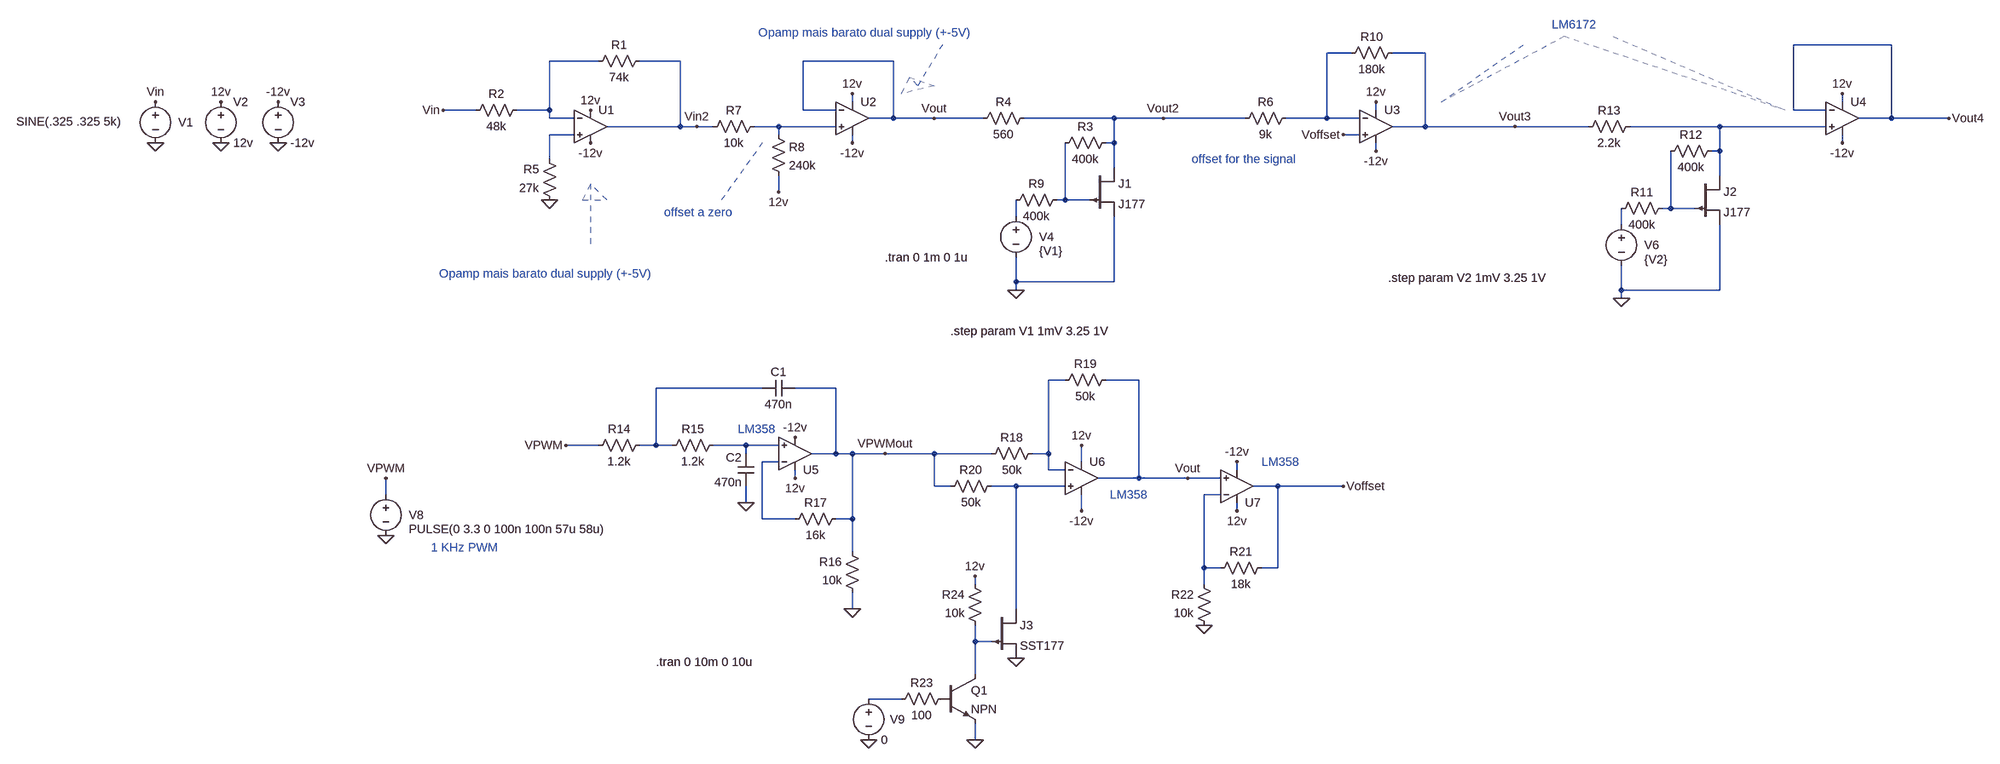
[diagram p0: schematic opamp_cir.asc]
opamp_cir.asc, the LTspice schematic file:
Version 4
SHEET 1 880 680
WIRE -544 -1792 -736 -1792
WIRE -1600 -1776 -1648 -1776
WIRE -1456 -1776 -1520 -1776
WIRE -3072 -1760 -3168 -1760
WIRE -2912 -1760 -2992 -1760
WIRE -2496 -1760 -2672 -1760
WIRE -2576 -1680 -2576 -1696
WIRE -640 -1680 -640 -1696
WIRE -3312 -1664 -3376 -1664
WIRE -3168 -1664 -3168 -1760
WIRE -3168 -1664 -3232 -1664
WIRE -2672 -1664 -2672 -1760
WIRE -2608 -1664 -2672 -1664
WIRE -1552 -1664 -1552 -1680
WIRE -736 -1664 -736 -1792
WIRE -672 -1664 -736 -1664
WIRE -3168 -1648 -3168 -1664
WIRE -3120 -1648 -3168 -1648
WIRE -2496 -1648 -2496 -1760
WIRE -2496 -1648 -2544 -1648
WIRE -2416 -1648 -2496 -1648
WIRE -2320 -1648 -2416 -1648
WIRE -2064 -1648 -2240 -1648
WIRE -1968 -1648 -2064 -1648
WIRE -1808 -1648 -1968 -1648
WIRE -1648 -1648 -1648 -1776
WIRE -1648 -1648 -1728 -1648
WIRE -1584 -1648 -1648 -1648
WIRE -544 -1648 -544 -1792
WIRE -544 -1648 -608 -1648
WIRE -432 -1648 -544 -1648
WIRE -2912 -1632 -2912 -1760
WIRE -2912 -1632 -3056 -1632
WIRE -2880 -1632 -2912 -1632
WIRE -2848 -1632 -2880 -1632
WIRE -2720 -1632 -2768 -1632
WIRE -2608 -1632 -2720 -1632
WIRE -1456 -1632 -1456 -1776
WIRE -1456 -1632 -1520 -1632
WIRE -1280 -1632 -1456 -1632
WIRE -1136 -1632 -1280 -1632
WIRE -880 -1632 -1056 -1632
WIRE -672 -1632 -880 -1632
WIRE -3120 -1616 -3168 -1616
WIRE -2720 -1616 -2720 -1632
WIRE -1584 -1616 -1616 -1616
WIRE -2576 -1600 -2576 -1616
WIRE -2064 -1600 -2064 -1648
WIRE -2064 -1600 -2080 -1600
WIRE -640 -1600 -640 -1616
WIRE -1552 -1584 -1552 -1600
WIRE -880 -1584 -880 -1632
WIRE -880 -1584 -896 -1584
WIRE -3168 -1568 -3168 -1616
WIRE -2064 -1552 -2064 -1600
WIRE -880 -1536 -880 -1584
WIRE -2720 -1504 -2720 -1536
WIRE -2160 -1488 -2160 -1600
WIRE -2160 -1488 -2176 -1488
WIRE -2112 -1488 -2160 -1488
WIRE -976 -1472 -976 -1584
WIRE -976 -1472 -992 -1472
WIRE -928 -1472 -976 -1472
WIRE -2256 -1456 -2256 -1488
WIRE -1072 -1440 -1072 -1472
WIRE -2256 -1328 -2256 -1376
WIRE -2064 -1328 -2064 -1456
WIRE -2064 -1328 -2256 -1328
WIRE -2256 -1312 -2256 -1328
WIRE -1072 -1312 -1072 -1360
WIRE -880 -1312 -880 -1440
WIRE -880 -1312 -1072 -1312
WIRE -1072 -1296 -1072 -1312
WIRE -2160 -1136 -2192 -1136
WIRE -2016 -1136 -2080 -1136
WIRE -2752 -1120 -2960 -1120
WIRE -2608 -1120 -2688 -1120
WIRE -3072 -1008 -3136 -1008
WIRE -2960 -1008 -2960 -1120
WIRE -2960 -1008 -2992 -1008
WIRE -2928 -1008 -2960 -1008
WIRE -2784 -1008 -2848 -1008
WIRE -2720 -1008 -2784 -1008
WIRE -2784 -992 -2784 -1008
WIRE -2608 -992 -2608 -1120
WIRE -2608 -992 -2656 -992
WIRE -2576 -992 -2608 -992
WIRE -2512 -992 -2576 -992
WIRE -2416 -992 -2512 -992
WIRE -2304 -992 -2416 -992
WIRE -2192 -992 -2192 -1136
WIRE -2192 -992 -2224 -992
WIRE -2720 -976 -2752 -976
WIRE -2128 -976 -2128 -1008
WIRE -2192 -960 -2192 -992
WIRE -2160 -960 -2192 -960
WIRE -1824 -960 -1824 -976
WIRE -2688 -944 -2688 -960
WIRE -2016 -944 -2016 -1136
WIRE -2016 -944 -2096 -944
WIRE -1920 -944 -2016 -944
WIRE -1856 -944 -1920 -944
WIRE -2416 -928 -2416 -992
WIRE -2384 -928 -2416 -928
WIRE -2256 -928 -2304 -928
WIRE -2160 -928 -2256 -928
WIRE -1744 -928 -1792 -928
WIRE -1616 -928 -1744 -928
WIRE -3488 -912 -3488 -944
WIRE -1856 -912 -1888 -912
WIRE -2784 -896 -2784 -928
WIRE -2128 -880 -2128 -912
WIRE -1824 -880 -1824 -896
WIRE -2752 -864 -2752 -976
WIRE -2688 -864 -2752 -864
WIRE -2576 -864 -2576 -992
WIRE -2576 -864 -2608 -864
WIRE -2576 -800 -2576 -864
WIRE -1888 -768 -1888 -912
WIRE -1856 -768 -1888 -768
WIRE -1744 -768 -1744 -928
WIRE -1744 -768 -1776 -768
WIRE -2336 -736 -2336 -752
WIRE -1888 -736 -1888 -768
WIRE -2576 -688 -2576 -720
WIRE -2256 -688 -2256 -928
WIRE -2336 -624 -2336 -656
WIRE -2304 -624 -2336 -624
WIRE -2336 -560 -2336 -624
WIRE -2480 -512 -2544 -512
WIRE -2336 -432 -2336 -464
FLAG -3952 -1600 0
FLAG -2416 -1648 Vout
FLAG -3712 -1600 0
FLAG -3824 -1600 0
FLAG -3824 -1680 12v
FLAG -3712 -1680 -12v
FLAG -3088 -1600 -12v
FLAG -3088 -1664 12v
FLAG -2880 -1632 Vin2
FLAG -2576 -1696 12v
FLAG -2576 -1600 -12v
FLAG -2720 -1504 12v
FLAG -2256 -1312 0
FLAG -3952 -1680 Vin
FLAG -3376 -1664 Vin
FLAG -3168 -1488 0
FLAG -1968 -1648 Vout2
FLAG -1552 -1680 12v
FLAG -1552 -1584 -12v
FLAG -1280 -1632 Vout3
FLAG -1072 -1296 0
FLAG -640 -1696 12v
FLAG -640 -1600 -12v
FLAG -432 -1648 Vout4
FLAG -1616 -1616 Voffset
FLAG -3488 -832 0
FLAG -3488 -944 VPWM
FLAG -3136 -1008 VPWM
FLAG -2688 -944 12v
FLAG -2688 -1024 -12v
FLAG -2784 -896 0
FLAG -2576 -688 0
FLAG -2512 -992 VPWMout
FLAG -2128 -1008 12v
FLAG -2128 -880 -12v
FLAG -1920 -944 Vout
FLAG -2256 -592 0
FLAG -2544 -432 0
FLAG -1824 -880 12v
FLAG -1824 -976 -12v
FLAG -1888 -656 0
FLAG -2336 -432 0
FLAG -2336 -752 12v
FLAG -1616 -928 Voffset
SYMBOL voltage -3952 -1696 R0
WINDOW 0 45 56 Left 2
WINDOW 3 -272 54 Left 2
WINDOW 123 0 0 Left 0
WINDOW 39 0 0 Left 0
SYMATTR InstName V1
SYMATTR Value SINE(.325 .325 5k)
SYMBOL res -2976 -1776 R90
WINDOW 0 0 56 VBottom 2
WINDOW 3 32 56 VTop 2
SYMATTR InstName R1
SYMATTR Value 74k
SYMBOL res -3216 -1680 R90
WINDOW 0 0 56 VBottom 2
WINDOW 3 32 56 VTop 2
SYMATTR InstName R2
SYMATTR Value 48k
SYMBOL Opamps\\UniversalOpamp2 -3088 -1632 R0
SYMATTR InstName U1
SYMBOL voltage -3824 -1696 R0
WINDOW 123 0 0 Left 0
WINDOW 39 0 0 Left 0
SYMATTR InstName V2
SYMATTR Value 12v
SYMBOL voltage -3712 -1696 R0
WINDOW 123 0 0 Left 0
WINDOW 39 0 0 Left 0
SYMATTR InstName V3
SYMATTR Value -12v
SYMBOL Opamps\\UniversalOpamp2 -2576 -1648 R0
SYMATTR InstName U2
SYMBOL res -2736 -1632 R0
SYMATTR InstName R8
SYMATTR Value 240k
SYMBOL res -2752 -1648 R90
WINDOW 0 0 56 VBottom 2
WINDOW 3 32 56 VTop 2
SYMATTR InstName R7
SYMATTR Value 10k
SYMBOL voltage -2256 -1472 R0
WINDOW 0 45 56 Left 2
WINDOW 3 45 84 Left 2
WINDOW 123 0 0 Left 0
WINDOW 39 0 0 Left 0
SYMATTR InstName V4
SYMATTR Value {V1}
SYMBOL pjf -2112 -1552 R0
SYMATTR InstName J1
SYMATTR Value J177
SYMBOL res -3152 -1472 R180
WINDOW 0 36 76 Left 2
WINDOW 3 36 40 Left 2
SYMATTR InstName R5
SYMATTR Value 27k
SYMBOL res -2272 -1472 R270
WINDOW 0 32 56 VTop 2
WINDOW 3 0 56 VBottom 2
SYMATTR InstName R9
SYMATTR Value 400k
SYMBOL res -2176 -1584 R270
WINDOW 0 32 56 VTop 2
WINDOW 3 0 56 VBottom 2
SYMATTR InstName R3
SYMATTR Value 400k
SYMBOL res -2336 -1632 R270
WINDOW 0 32 56 VTop 2
WINDOW 3 0 56 VBottom 2
SYMATTR InstName R4
SYMATTR Value 560
SYMBOL Opamps\\UniversalOpamp2 -1552 -1632 R0
SYMATTR InstName U3
SYMBOL res -1712 -1664 R90
WINDOW 0 0 56 VBottom 2
WINDOW 3 32 56 VTop 2
SYMATTR InstName R6
SYMATTR Value 9k
SYMBOL res -1504 -1792 R90
WINDOW 0 0 56 VBottom 2
WINDOW 3 32 56 VTop 2
SYMATTR InstName R10
SYMATTR Value 180k
SYMBOL voltage -1072 -1456 R0
WINDOW 0 45 56 Left 2
WINDOW 3 45 84 Left 2
WINDOW 123 0 0 Left 0
WINDOW 39 0 0 Left 0
SYMATTR InstName V6
SYMATTR Value {V2}
SYMBOL pjf -928 -1536 R0
SYMATTR InstName J2
SYMATTR Value J177
SYMBOL res -1088 -1456 R270
WINDOW 0 32 56 VTop 2
WINDOW 3 0 56 VBottom 2
SYMATTR InstName R11
SYMATTR Value 400k
SYMBOL res -992 -1568 R270
WINDOW 0 32 56 VTop 2
WINDOW 3 0 56 VBottom 2
SYMATTR InstName R12
SYMATTR Value 400k
SYMBOL res -1152 -1616 R270
WINDOW 0 32 56 VTop 2
WINDOW 3 0 56 VBottom 2
SYMATTR InstName R13
SYMATTR Value 2.2k
SYMBOL Opamps\\UniversalOpamp2 -640 -1648 R0
SYMATTR InstName U4
SYMBOL voltage -3488 -928 R0
WINDOW 0 45 56 Left 2
WINDOW 3 45 84 Left 2
WINDOW 123 0 0 Left 0
WINDOW 39 0 0 Left 0
SYMATTR InstName V8
SYMATTR Value PULSE(0 3.3 0 100n 100n 57u 58u)
SYMBOL res -2976 -1024 R90
WINDOW 0 0 56 VBottom 2
WINDOW 3 32 56 VTop 2
SYMATTR InstName R14
SYMATTR Value 1.2k
SYMBOL res -2832 -1024 R90
WINDOW 0 0 56 VBottom 2
WINDOW 3 32 56 VTop 2
SYMATTR InstName R15
SYMATTR Value 1.2k
SYMBOL res -2560 -704 R180
WINDOW 0 36 76 Left 2
WINDOW 3 36 40 Left 2
SYMATTR InstName R16
SYMATTR Value 10k
SYMBOL res -2704 -848 R270
WINDOW 0 32 56 VTop 2
WINDOW 3 0 56 VBottom 2
SYMATTR InstName R17
SYMATTR Value 16k
SYMBOL cap -2688 -1136 R90
WINDOW 0 0 32 VBottom 2
WINDOW 3 32 32 VTop 2
SYMATTR InstName C1
SYMATTR Value 470n
SYMBOL cap -2768 -928 R180
WINDOW 0 24 56 Left 2
WINDOW 3 24 8 Left 2
SYMATTR InstName C2
SYMATTR Value 470n
SYMBOL Opamps\\UniversalOpamp2 -2688 -992 M180
SYMATTR InstName U5
SYMBOL Opamps\\UniversalOpamp2 -2128 -944 R0
SYMATTR InstName U6
SYMBOL res -2208 -1008 R90
WINDOW 0 0 56 VBottom 2
WINDOW 3 32 56 VTop 2
SYMATTR InstName R18
SYMATTR Value 50k
SYMBOL res -2064 -1152 R90
WINDOW 0 0 56 VBottom 2
WINDOW 3 32 56 VTop 2
SYMATTR InstName R19
SYMATTR Value 50k
SYMBOL pjf -2304 -688 R0
SYMATTR InstName J3
SYMATTR Value SST177
SYMBOL res -2288 -944 R90
WINDOW 0 0 56 VBottom 2
WINDOW 3 32 56 VTop 2
SYMATTR InstName R20
SYMATTR Value 50k
SYMBOL voltage -2544 -528 R0
WINDOW 123 0 0 Left 0
WINDOW 39 0 0 Left 0
WINDOW 0 42 56 Left 2
SYMATTR InstName V9
SYMATTR Value 0
SYMBOL Opamps\\UniversalOpamp2 -1824 -928 M180
SYMATTR InstName U7
SYMBOL res -1760 -784 R90
WINDOW 0 0 56 VBottom 2
WINDOW 3 32 56 VTop 2
SYMATTR InstName R21
SYMATTR Value 18k
SYMBOL res -1872 -640 R180
WINDOW 0 36 76 Left 2
WINDOW 3 36 40 Left 2
SYMATTR InstName R22
SYMATTR Value 10k
SYMBOL npn -2400 -560 R0
SYMATTR InstName Q1
SYMBOL res -2384 -528 R90
WINDOW 0 0 56 VBottom 2
WINDOW 3 32 56 VTop 2
SYMATTR InstName R23
SYMATTR Value 100
SYMBOL res -2320 -640 R180
WINDOW 0 36 76 Left 2
WINDOW 3 36 40 Left 2
SYMATTR InstName R24
SYMATTR Value 10k
TEXT -1528 -1336 Left 2 !.step param V2 1mV 3.25 1V
TEXT -2512 -1376 Left 2 !.tran 0 1m 0 1u
TEXT -3384 -1344 Left 2 ;Opamp mais barato dual supply (+-5V)
TEXT -2760 -1816 Left 2 ;Opamp mais barato dual supply (+-5V)
TEXT -2944 -1464 Left 2 ;offset a zero
TEXT -2384 -1232 Left 2 !.step param V1 1mV 3.25 1V
TEXT -1208 -1832 Left 2 ;LM6172
TEXT -1912 -1568 Left 2 ;offset for the signal
TEXT -3400 -808 Left 2 ;1 KHz PWM
TEXT -2960 -584 Left 2 !.tran 0 10m 0 10u
TEXT -2072 -912 Left 2 ;LM358
TEXT -2800 -1040 Left 2 ;LM358
TEXT -1776 -976 Left 2 ;LM358
LINE Normal -3088 -1520 -3088 -1392 2
LINE Normal -3056 -1488 -3088 -1520 2
LINE Normal -3104 -1488 -3056 -1488 2
LINE Normal -3088 -1520 -3104 -1488 2
LINE Normal -2480 -1696 -2464 -1728 2
LINE Normal -2416 -1712 -2480 -1696 2
LINE Normal -2464 -1728 -2416 -1712 2
LINE Normal -2448 -1712 -2464 -1728 2
LINE Normal -2400 -1792 -2448 -1712 2
LINE Normal -2752 -1600 -2832 -1488 2
LINE Normal -1424 -1680 -1264 -1792 2
LINE Normal -1184 -1808 -1424 -1680 2
LINE Normal -752 -1664 -1184 -1808 2
LINE Normal -1088 -1808 -752 -1664 2

The netlist it stands for:
* opamp_cir.asc
V1 Vin 0 SINE(.325 .325 5k)
R1 Vin2 N002 74k
R2 N002 Vin 48k
XU1 N005 N002 12v -12v Vin2 level.2 Avol=1Meg GBW=10Meg Slew=10Meg ilimit=25m rail=0 Vos=0 phimargin=45 en=0 enk=0 in=0 ink=0 Rin=500Meg  ; pins IN+ IN- V+ V- OUT
V2 12v 0 12v
V3 -12v 0 -12v
XU2 N003 Vout 12v -12v Vout level.2 Avol=1Meg GBW=10Meg Slew=10Meg ilimit=25m rail=0 Vos=0 phimargin=45 en=0 enk=0 in=0 ink=0 Rin=500Meg  ; pins IN+ IN- V+ V- OUT
R8 N003 12v 240k
R7 N003 Vin2 10k
V4 N008 0 {V1}
J1 Vout2 N006 0 J177
R5 0 N005 27k
R9 N008 N006 400k
R3 N006 Vout2 400k
R4 Vout Vout2 560
XU3 Voffset N001 12v -12v Vout3 level.2 Avol=1Meg GBW=10Meg Slew=10Meg ilimit=25m rail=0 Vos=0 phimargin=45 en=0 enk=0 in=0 ink=0 Rin=500Meg  ; pins IN+ IN- V+ V- OUT
R6 N001 Vout2 9k
R10 Vout3 N001 180k
V6 N009 0 {V2}
J2 N004 N007 0 J177
R11 N009 N007 400k
R12 N007 N004 400k
R13 Vout3 N004 2.2k
XU4 N004 Vout4 12v -12v Vout4 level.2 Avol=1Meg GBW=10Meg Slew=10Meg ilimit=25m rail=0 Vos=0 phimargin=45 en=0 enk=0 in=0 ink=0 Rin=500Meg  ; pins IN+ IN- V+ V- OUT
V8 VPWM 0 PULSE(0 3.3 0 100n 100n 57u 58u)
R14 N011 VPWM 1.2k
R15 N012 N011 1.2k
R16 0 VPWMout 10k
R17 N013 VPWMout 16k
C1 VPWMout N011 470n
C2 0 N012 470n
XU5 N012 N013 12v -12v VPWMout level.2 Avol=1Meg GBW=10Meg Slew=10Meg ilimit=25m rail=0 Vos=0 phimargin=45 en=0 enk=0 in=0 ink=0 Rin=500Meg  ; pins IN+ IN- V+ V- OUT
XU6 N014 N010 12v -12v Vout level.2 Avol=1Meg GBW=10Meg Slew=10Meg ilimit=25m rail=0 Vos=0 phimargin=45 en=0 enk=0 in=0 ink=0 Rin=500Meg  ; pins IN+ IN- V+ V- OUT
R18 N010 VPWMout 50k
R19 Vout N010 50k
J3 N014 N016 0 SST177
R20 N014 VPWMout 50k
V9 N017 0 0
XU7 Vout N015 12v -12v Voffset level.2 Avol=1Meg GBW=10Meg Slew=10Meg ilimit=25m rail=0 Vos=0 phimargin=45 en=0 enk=0 in=0 ink=0 Rin=500Meg  ; pins IN+ IN- V+ V- OUT
R21 Voffset N015 18k
R22 0 N015 10k
Q1 N016 P001 0 0 NPN
R23 P001 N017 100
R24 N016 12v 10k
.model NPN NPN
.model PNP PNP
.lib standard.bjt
.model NJF NJF
.model PJF PJF
.lib standard.jft
.step param V2 1mV 3.25 1V
.tran 0 1m 0 1u
* Opamp mais barato dual supply (+-5V)
* Opamp mais barato dual supply (+-5V)
* offset a zero
.step param V1 1mV 3.25 1V
* LM6172
* offset for the signal
* 1 KHz PWM
.tran 0 10m 0 10u
* LM358
* LM358
* LM358
.lib UniversalOpamps2.sub
.backanno
.end